# Altium schematic sheet DCDC_Motherbord.SchDoc
size A4; SheetNumber: 1; SheetTotal: 1
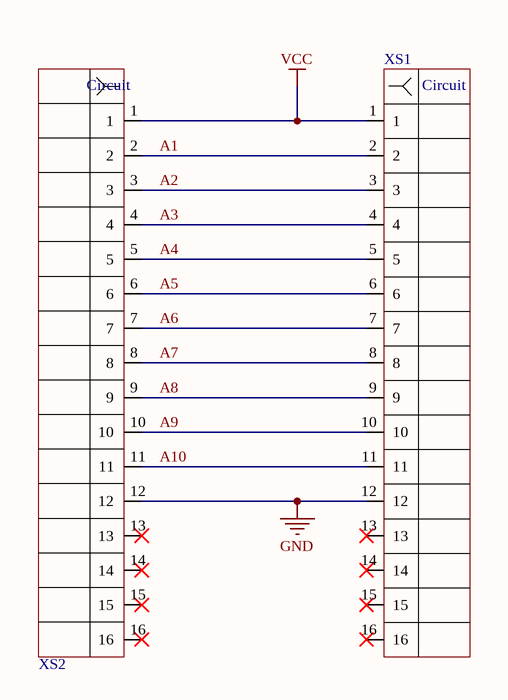
[diagram p0: DCDC_Motherbord.SchDoc]

## Parts
XS1  PBD-16  [PBD-16-3D]  (value not drawn)
XS2  PBD-16  [PBD-16-3D]  (value not drawn)

## Nets
GND: XS1.12 XS2.12
VCC: XS1.1 XS2.1
A1: XS1.2 XS2.2
A2: XS1.3 XS2.3
A3: XS1.4 XS2.4
A4: XS1.5 XS2.5
A5: XS1.6 XS2.6
A6: XS1.7 XS2.7
A7: XS1.8 XS2.8
A8: XS1.9 XS2.9
A9: XS1.10 XS2.10
A10: XS1.11 XS2.11

Not connected (* = marked no-connect by the designer): XS1 13* 14* 15* 16*; XS2 13* 14* 15* 16*

## Notes on the sheet
- (in symbol SH2-16G) Circuit

## Library data of the parts
XS1 = SH2-16G: CONN RCPT 16POS 0.1 GOLD PCB; System: Connector; Part Number: SH2-16G; HelpURL: https://www.digikey.com/en/products/detail/on-shore-technology-inc/SH2-16G/2721215; Digi-Key Part Number: ED3071-ND; Price$: 0.20250; Manufacturer Part Number: SH2-16G; Package: Socket 16POS 2.54mm
XS2 = SH2-16G: CONN RCPT 16POS 0.1 GOLD PCB; Part Number: SH2-16G; HelpURL: https://www.digikey.com/en/products/detail/on-shore-technology-inc/SH2-16G/2721215; Digi-Key Part Number: ED3071-ND; Price$: 0.20250; Manufacturer Part Number: SH2-16G; Package: Socket 16POS 2.54mm